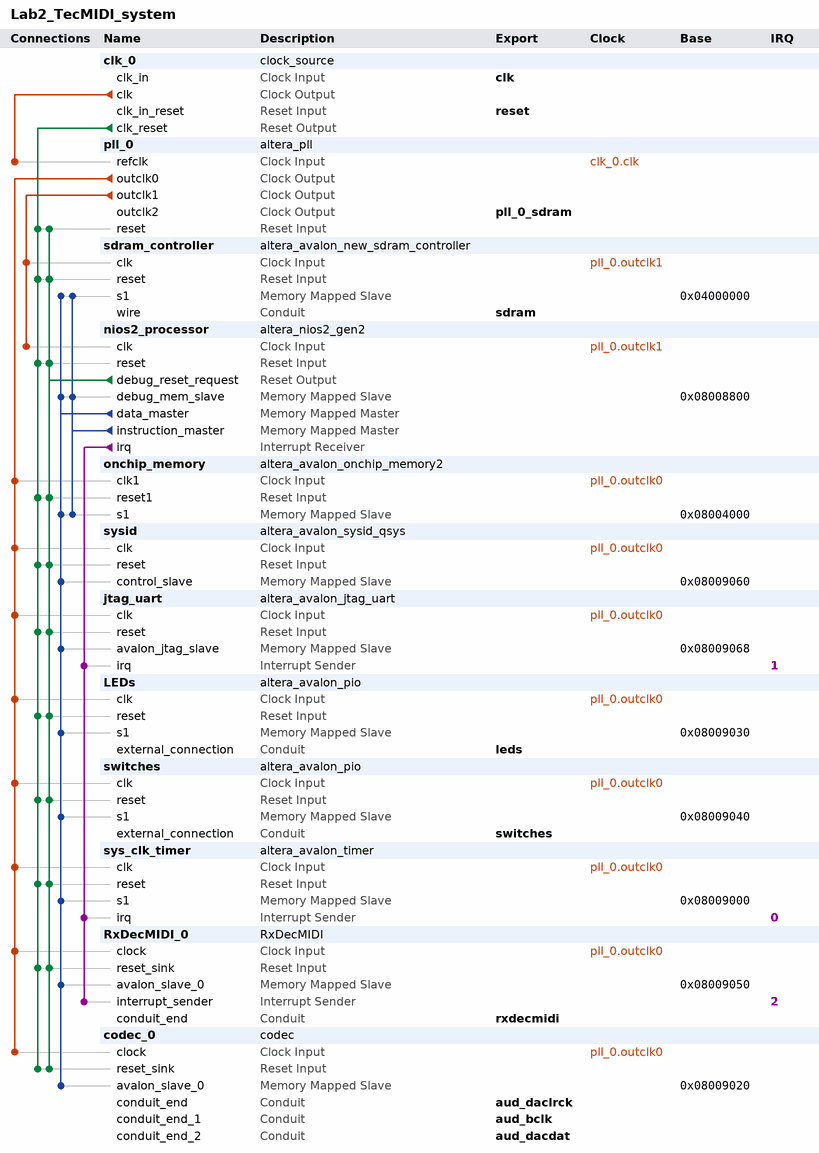
[diagram p0: system contents]
# Platform Designer (Qsys) system Lab2_TecMIDI_system, Cyclone V 5CSEMA5F31C6
# Parameters at their usual value, and those the tool derives, are not listed.
package require -exact qsys 15.1
create_system Lab2_TecMIDI_system
set_project_property DEVICE_FAMILY {Cyclone V}
set_project_property DEVICE 5CSEMA5F31C6

add_instance clk_0 clock_source 15.1
set_instance_parameter_value clk_0 clockFrequency 50000000

add_instance pll_0 altera_pll 15.1
set_instance_parameter_value pll_0 gui_device_speed_grade 1
set_instance_parameter_value pll_0 gui_number_of_clocks 3
set_instance_parameter_value pll_0 gui_operation_mode normal
set_instance_parameter_value pll_0 gui_output_clock_frequency0 50.0
set_instance_parameter_value pll_0 gui_output_clock_frequency1 100.0
set_instance_parameter_value pll_0 gui_output_clock_frequency2 100.0
set_instance_parameter_value pll_0 gui_phase_shift2 -3750
set_instance_parameter_value pll_0 gui_pll_mode {Integer-N PLL}
set_instance_parameter_value pll_0 gui_reference_clock_frequency 50.0
set_instance_parameter_value pll_0 gui_use_locked false

add_instance sdram_controller altera_avalon_new_sdram_controller 15.1
set_instance_parameter_value sdram_controller TAC 5.4
set_instance_parameter_value sdram_controller TRCD 15.0
set_instance_parameter_value sdram_controller TRP 15.0
set_instance_parameter_value sdram_controller casLatency 3
set_instance_parameter_value sdram_controller columnWidth 10
set_instance_parameter_value sdram_controller dataWidth 16
set_instance_parameter_value sdram_controller generateSimulationModel false
set_instance_parameter_value sdram_controller model single_Micron_MT48LC4M32B2_7_chip
set_instance_parameter_value sdram_controller numberOfBanks 4
set_instance_parameter_value sdram_controller numberOfChipSelects 1
set_instance_parameter_value sdram_controller powerUpDelay 100.0
set_instance_parameter_value sdram_controller refreshPeriod 7.08125
set_instance_parameter_value sdram_controller rowWidth 13

add_instance nios2_processor altera_nios2_gen2 15.1
set_instance_parameter_value nios2_processor dcache_size 2048
set_instance_parameter_value nios2_processor debug_datatrigger 2
set_instance_parameter_value nios2_processor debug_hwbreakpoint 2
set_instance_parameter_value nios2_processor debug_traceType instruction_trace
set_instance_parameter_value nios2_processor exceptionSlave sdram_controller.s1
set_instance_parameter_value nios2_processor icache_size 4096
set_instance_parameter_value nios2_processor impl Fast
set_instance_parameter_value nios2_processor resetSlave sdram_controller.s1

add_instance onchip_memory altera_avalon_onchip_memory2 15.1
set_instance_parameter_value onchip_memory dataWidth 32
set_instance_parameter_value onchip_memory dualPort false
set_instance_parameter_value onchip_memory initMemContent true
set_instance_parameter_value onchip_memory initializationFileName onchip_mem.hex
set_instance_parameter_value onchip_memory memorySize 16384

add_instance sysid altera_avalon_sysid_qsys 15.1
set_instance_parameter_value sysid id 0

add_instance jtag_uart altera_avalon_jtag_uart 15.1
set_instance_parameter_value jtag_uart simInteractiveOptions NO_INTERACTIVE_WINDOWS

add_instance LEDs altera_avalon_pio 15.1
set_instance_parameter_value LEDs direction Output
set_instance_parameter_value LEDs width 8

add_instance switches altera_avalon_pio 15.1
set_instance_parameter_value switches direction Input
set_instance_parameter_value switches width 8

add_instance sys_clk_timer altera_avalon_timer 15.1
set_instance_parameter_value sys_clk_timer period 1
set_instance_parameter_value sys_clk_timer periodUnits MSEC

add_instance RxDecMIDI_0 RxDecMIDI 1.0

add_instance codec_0 codec 1.0

# connections
add_connection clk_0.clk pll_0.refclk clock
add_connection pll_0.outclk0 codec_0.clock clock
add_connection pll_0.outclk0 jtag_uart.clk clock
add_connection pll_0.outclk0 LEDs.clk clock
add_connection pll_0.outclk0 onchip_memory.clk1 clock
add_connection pll_0.outclk0 RxDecMIDI_0.clock clock
add_connection pll_0.outclk0 switches.clk clock
add_connection pll_0.outclk0 sys_clk_timer.clk clock
add_connection pll_0.outclk0 sysid.clk clock
add_connection pll_0.outclk1 nios2_processor.clk clock
add_connection pll_0.outclk1 sdram_controller.clk clock
add_connection clk_0.clk_reset codec_0.reset_sink reset
add_connection clk_0.clk_reset jtag_uart.reset reset
add_connection clk_0.clk_reset LEDs.reset reset
add_connection clk_0.clk_reset nios2_processor.reset reset
add_connection clk_0.clk_reset onchip_memory.reset1 reset
add_connection clk_0.clk_reset pll_0.reset reset
add_connection clk_0.clk_reset RxDecMIDI_0.reset_sink reset
add_connection clk_0.clk_reset sdram_controller.reset reset
add_connection clk_0.clk_reset switches.reset reset
add_connection clk_0.clk_reset sys_clk_timer.reset reset
add_connection clk_0.clk_reset sysid.reset reset
add_connection nios2_processor.debug_reset_request codec_0.reset_sink reset
add_connection nios2_processor.debug_reset_request jtag_uart.reset reset
add_connection nios2_processor.debug_reset_request LEDs.reset reset
add_connection nios2_processor.debug_reset_request nios2_processor.reset reset
add_connection nios2_processor.debug_reset_request onchip_memory.reset1 reset
add_connection nios2_processor.debug_reset_request pll_0.reset reset
add_connection nios2_processor.debug_reset_request RxDecMIDI_0.reset_sink reset
add_connection nios2_processor.debug_reset_request sdram_controller.reset reset
add_connection nios2_processor.debug_reset_request switches.reset reset
add_connection nios2_processor.debug_reset_request sys_clk_timer.reset reset
add_connection nios2_processor.debug_reset_request sysid.reset reset
add_connection nios2_processor.data_master codec_0.avalon_slave_0 avalon
set_connection_parameter_value nios2_processor.data_master/codec_0.avalon_slave_0 baseAddress 0x08009020
add_connection nios2_processor.data_master jtag_uart.avalon_jtag_slave avalon
set_connection_parameter_value nios2_processor.data_master/jtag_uart.avalon_jtag_slave baseAddress 0x08009068
add_connection nios2_processor.data_master LEDs.s1 avalon
set_connection_parameter_value nios2_processor.data_master/LEDs.s1 baseAddress 0x08009030
add_connection nios2_processor.data_master nios2_processor.debug_mem_slave avalon
set_connection_parameter_value nios2_processor.data_master/nios2_processor.debug_mem_slave baseAddress 0x08008800
add_connection nios2_processor.data_master onchip_memory.s1 avalon
set_connection_parameter_value nios2_processor.data_master/onchip_memory.s1 baseAddress 0x08004000
add_connection nios2_processor.data_master RxDecMIDI_0.avalon_slave_0 avalon
set_connection_parameter_value nios2_processor.data_master/RxDecMIDI_0.avalon_slave_0 baseAddress 0x08009050
add_connection nios2_processor.data_master sdram_controller.s1 avalon
set_connection_parameter_value nios2_processor.data_master/sdram_controller.s1 baseAddress 0x04000000
add_connection nios2_processor.data_master switches.s1 avalon
set_connection_parameter_value nios2_processor.data_master/switches.s1 baseAddress 0x08009040
add_connection nios2_processor.data_master sys_clk_timer.s1 avalon
set_connection_parameter_value nios2_processor.data_master/sys_clk_timer.s1 baseAddress 0x08009000
add_connection nios2_processor.data_master sysid.control_slave avalon
set_connection_parameter_value nios2_processor.data_master/sysid.control_slave baseAddress 0x08009060
add_connection nios2_processor.instruction_master nios2_processor.debug_mem_slave avalon
set_connection_parameter_value nios2_processor.instruction_master/nios2_processor.debug_mem_slave baseAddress 0x08008800
add_connection nios2_processor.instruction_master onchip_memory.s1 avalon
set_connection_parameter_value nios2_processor.instruction_master/onchip_memory.s1 baseAddress 0x08004000
add_connection nios2_processor.instruction_master sdram_controller.s1 avalon
set_connection_parameter_value nios2_processor.instruction_master/sdram_controller.s1 baseAddress 0x04000000
add_connection nios2_processor.irq jtag_uart.irq interrupt
set_connection_parameter_value nios2_processor.irq/jtag_uart.irq irqNumber 1
add_connection nios2_processor.irq RxDecMIDI_0.interrupt_sender interrupt
set_connection_parameter_value nios2_processor.irq/RxDecMIDI_0.interrupt_sender irqNumber 2
add_connection nios2_processor.irq sys_clk_timer.irq interrupt
set_connection_parameter_value nios2_processor.irq/sys_clk_timer.irq irqNumber 0

# exported interfaces
add_interface aud_bclk conduit end
set_interface_property aud_bclk EXPORT_OF codec_0.conduit_end_1
add_interface aud_dacdat conduit end
set_interface_property aud_dacdat EXPORT_OF codec_0.conduit_end_2
add_interface aud_daclrck conduit end
set_interface_property aud_daclrck EXPORT_OF codec_0.conduit_end
add_interface clk clock sink
set_interface_property clk EXPORT_OF clk_0.clk_in
add_interface leds conduit end
set_interface_property leds EXPORT_OF LEDs.external_connection
add_interface pll_0_sdram clock source
set_interface_property pll_0_sdram EXPORT_OF pll_0.outclk2
add_interface reset reset sink
set_interface_property reset EXPORT_OF clk_0.clk_in_reset
add_interface rxdecmidi conduit end
set_interface_property rxdecmidi EXPORT_OF RxDecMIDI_0.conduit_end
add_interface sdram conduit end
set_interface_property sdram EXPORT_OF sdram_controller.wire
add_interface switches conduit end
set_interface_property switches EXPORT_OF switches.external_connection

set_interconnect_requirement {$system} qsys_mm.clockCrossingAdapter HANDSHAKE
set_interconnect_requirement {$system} qsys_mm.enableEccProtection FALSE
set_interconnect_requirement {$system} qsys_mm.insertDefaultSlave FALSE
set_interconnect_requirement {$system} qsys_mm.maxAdditionalLatency 1

save_system Lab2_TecMIDI_system.qsys
